# EAGLE design switchmountingboard (EAGLE 9.1.1)
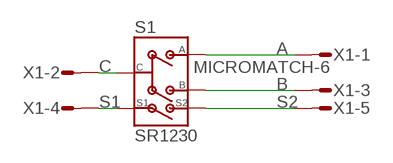
[diagram p0: schematic, sheet 1]

## Parts
S1  SR1230  [RE111F-4]
X1  MICROMATCH-6  [MICROMATCH-6]

## Nets
A: S1.A X1.1
B: S1.B X1.3
C: S1.C X1.2
S1: S1.S1 X1.4
S2: S1.S2 X1.5
Unconnected: X1.6

## Library data of the parts
S1 = rotaryencoderswitch:SR1230: Rotary Encoder with Push Button As per JayCar SR1230: https://www.jaycar.com.au/rotary-encoder-with-pushbutton/p/SR1230 Appears to be an Alpha R111-F41 version.; MANUFACTURER: Alpha
X1 = con-amp-micromatch:MICROMATCH-6: MicroMaTch 6 7-215464-6 / 0-215464-6 Drawing Number C-215464 DDEController.pdf; MPN: 7-215464-6; OC_FARNELL: 3784630; OC_NEWARK: 19R8125

## Board
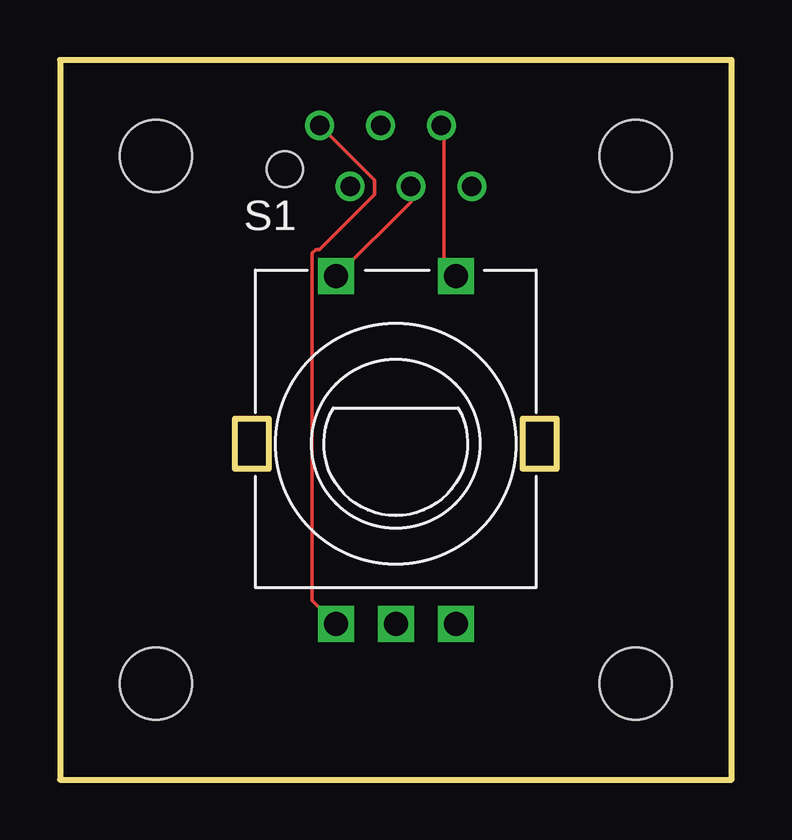
[diagram p1: board, top side]
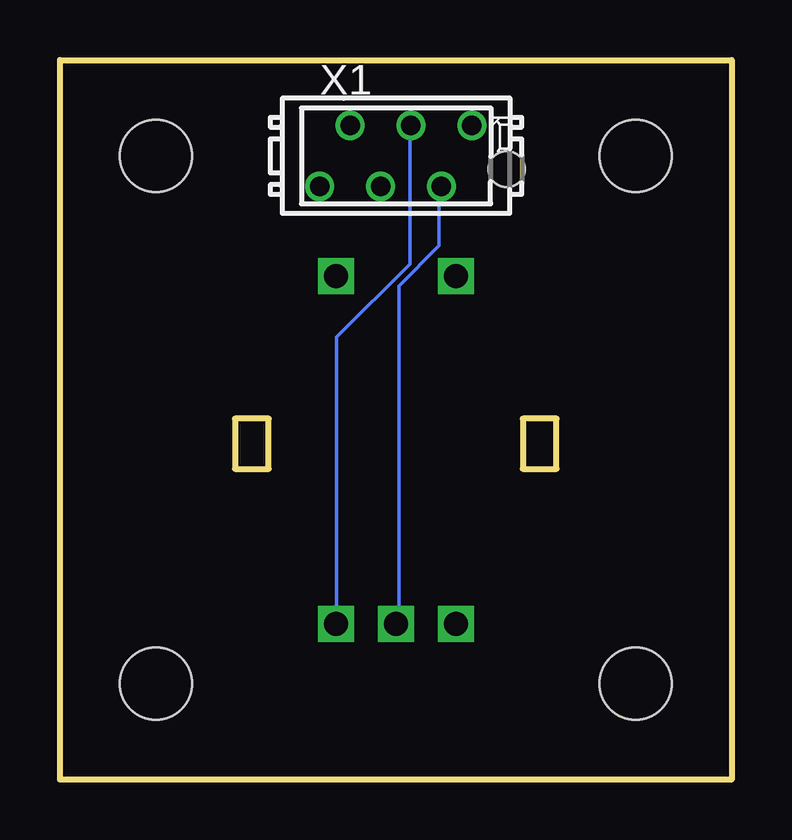
[diagram p2: board, bottom side, seen from below]

Size 28 x 30 mm. Coordinates in mm from the lower left corner, seen from the top.
Outline: 0,0 28,0 28,30 0,30 0,0
Outline: 7.3,15.05 8.7,15.05 8.7,12.95 7.3,12.95 7.3,15.05
Outline: 19.3,12.95 19.3,15.05 20.7,15.05 20.7,12.95 19.3,12.95
Copper layers (1*16): Top 0.035559375mm / dielectric 1.6mm / Bottom 0.035559375mm
Design rules "oshpark-2layer": minimum track width 6mil, minimum drill 10mil, track to track 6mil, track to pad 6mil, pad to pad 6mil, via to via 6mil, smd to smd 6mil, copper to edge 15mil, drill to drill 6mil, minimum pad ring 5mil, minimum via ring 5mil, stop-mask expansion 2.5mil, vias tented up to drill 0mil, thermal gap 10mil
Holes 3 mm at 4,26 24,26 4,4 24,4

### Footprints (pad centres in the part's own frame; a part is rotated, then mirrored left to right if it is on the bottom)
RE111F-4 = drill 1 square: A -2.5,-7.5; B 2.5,-7.5; C 0,-7.5; S1 -2.5,7; S2 2.5,7
MICROMATCH-6 = drill 0.813: 1 3.175,1.27; 2 1.905,-1.27; 3 0.635,1.27; 4 -0.635,-1.27; 5 -1.905,1.27; 6 -3.175,-1.27 | hole 1.5: 4.63,-0.55

### Placement (x,y rotation side)
S1  14,14 0 top
X1  14,26 0 bottom

### Tracks (layer width: path | path; a pad name or v marks a point on that pad's centre or on a via)
A
  Top 0.152: X1.1 10.97,27.13 13.11,24.99 13.11,24.38 10.82,22.1 10.67,22.1 10.52,21.95 10.52,7.47 11.43,6.55 S1.A
B
  Bottom 0.152: X1.3 13.41,27.13 13.41,21.49 16.46,18.44 16.46,6.55 S1.B
C
  Bottom 0.152: X1.2 12.19,24.69 12.19,22.25 13.87,20.57 13.87,6.55 S1.C
S1
  Top 0.152: X1.4 14.63,24.69 14.63,24.08 11.58,21.03 S1.S1
S2
  Top 0.152: X1.5 16,27.13 16,21.49 16.46,21.03 S1.S2